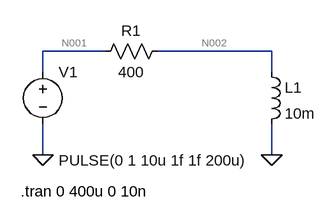
[diagram p0: schematic RL-цепь.asc]
RL-цепь.asc, the LTspice schematic file:
Version 4
SHEET 1 880 680
WIRE 0 16 -96 16
WIRE 256 16 80 16
WIRE -96 48 -96 16
WIRE 256 48 256 16
WIRE -96 176 -96 128
WIRE 256 176 256 128
FLAG -96 176 0
FLAG 256 176 0
SYMBOL voltage -96 32 R0
WINDOW 3 24 152 Left 2
WINDOW 123 0 0 Left 0
WINDOW 39 24 180 Left 2
SYMATTR InstName V1
SYMATTR Value PULSE(0 1 10u 1f 1f 200u)
SYMBOL res -16 32 R270
WINDOW 0 32 56 VTop 2
WINDOW 3 0 56 VBottom 2
SYMATTR InstName R1
SYMATTR Value 400
SYMBOL ind 240 32 R0
SYMATTR InstName L1
SYMATTR Value 10m
TEXT -130 232 Left 2 !.tran 0 400u 0 10n

The netlist it stands for:
* RL-цепь.asc
V1 N001 0 PULSE(0 1 10u 1f 1f 200u)
R1 N001 N002 400
L1 N002 0 10m
.tran 0 400u 0 10n
.backanno
.end

* Results of the author's LTspice run, read from the files saved beside the schematic
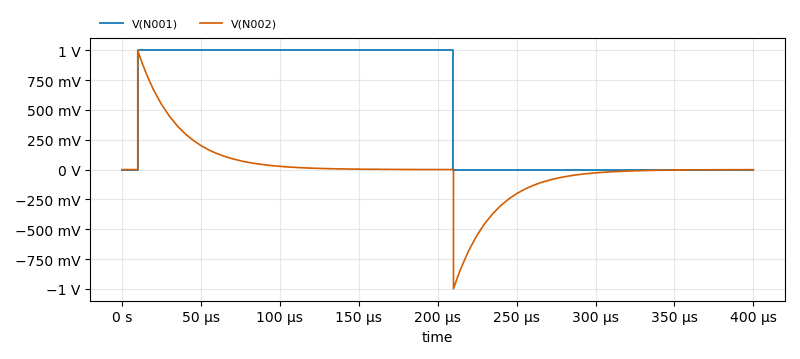
[diagram p1: Transient Analysis of RL-цепь.asc, plotted from the saved traces]
* Transient Analysis, 1 run:
*   V(N001): min 0 V, max 1 V, average 500 mV, rms 707.1 mV, last 0 V
*   V(N002): min -999.7 mV, max 1 V, average 6.781 µV, rms 251.1 mV, last -500.3 µV